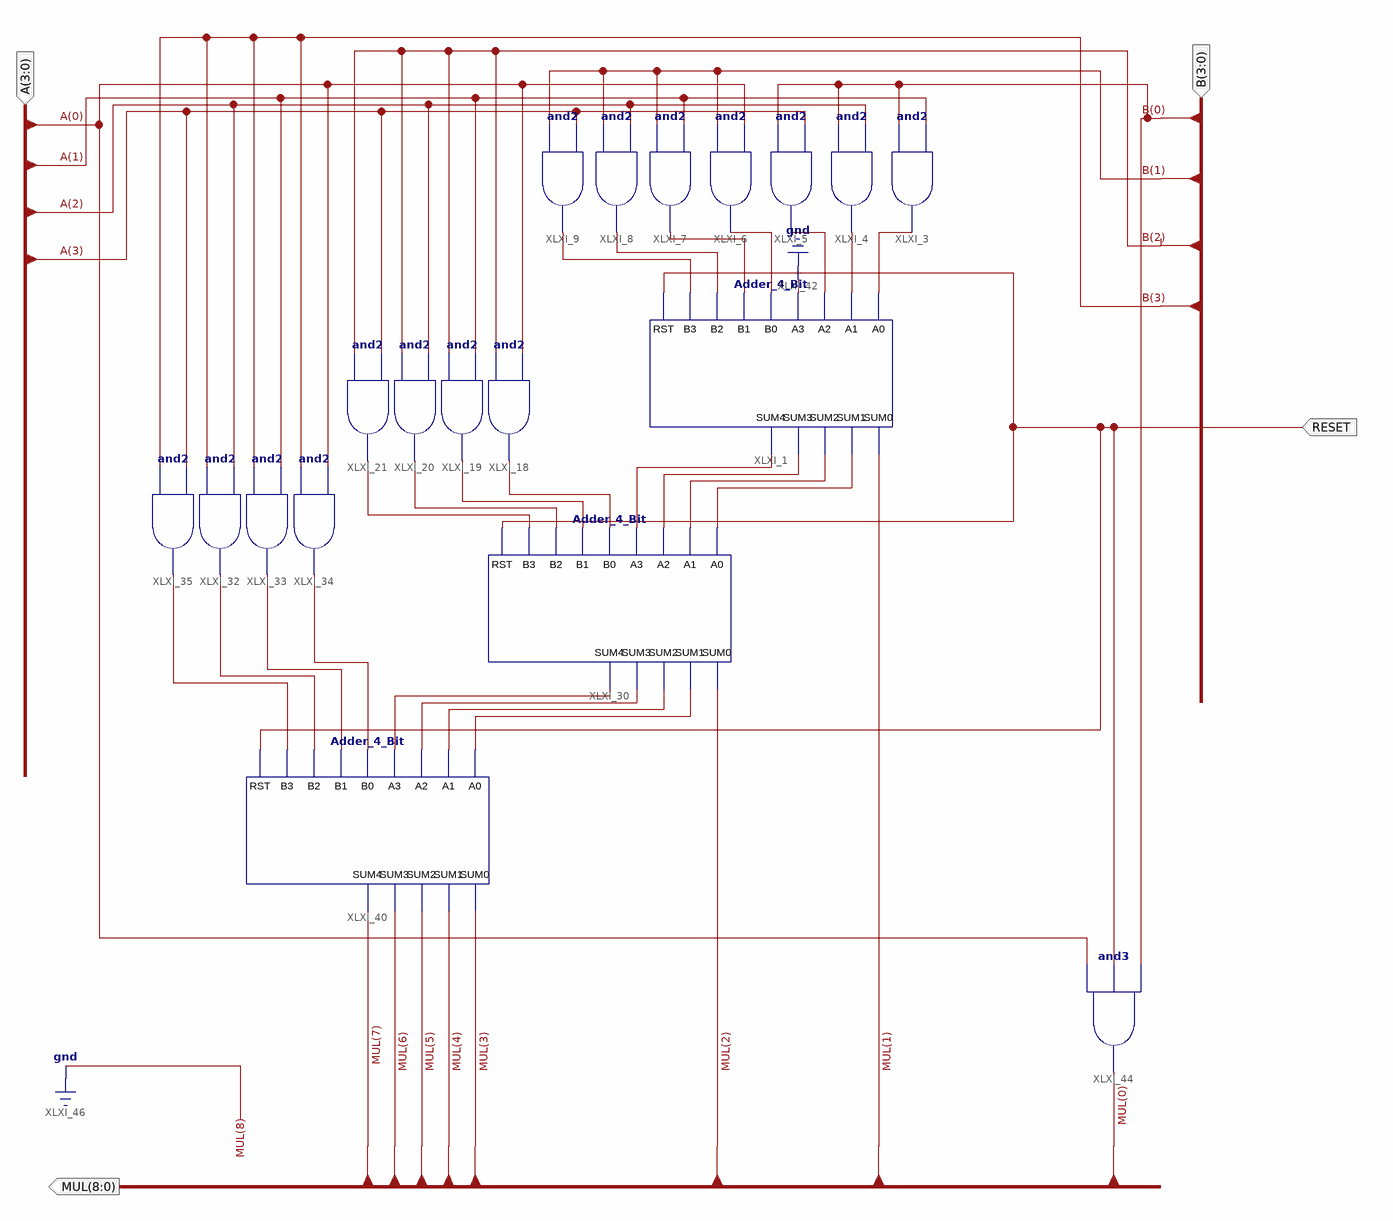
[diagram p0: schematic sheet 1]
// Xilinx ISE schematic Multiplier_4_Bit.sch (spartan6) as structural Verilog: 19 symbols, 4 ports
module Multiplier_4_Bit (
  input  [3:0] A,
  input  [3:0] B,
  input  RESET,
  output [8:0] MUL
);

  wire XLXN_21, XLXN_22, XLXN_23, XLXN_24, XLXN_25, XLXN_30, XLXN_31, XLXN_39, XLXN_40, XLXN_41, XLXN_43,
       XLXN_44, XLXN_45, XLXN_46, XLXN_50, XLXN_51, XLXN_52, XLXN_53, XLXN_54, XLXN_55, XLXN_56, XLXN_57,
       XLXN_67;

  and XLXI_3 (XLXN_21, B[0], A[1]);
  and XLXI_4 (XLXN_22, B[0], A[2]);
  and XLXI_5 (XLXN_23, B[0], A[3]);
  and XLXI_6 (XLXN_24, B[1], A[0]);
  and XLXI_7 (XLXN_25, B[1], A[1]);
  and XLXI_8 (XLXN_30, B[1], A[2]);
  and XLXI_9 (XLXN_31, B[1], A[3]);
  Adder_4_Bit XLXI_1 (
    .A0(XLXN_21), .A1(XLXN_22), .A2(XLXN_23), .A3(1'b0), .B0(XLXN_24), .B1(XLXN_25), .B2(XLXN_30),
    .B3(XLXN_31), .RST(RESET), .SUM0(MUL[1]), .SUM1(XLXN_39), .SUM2(XLXN_40), .SUM3(XLXN_41), .SUM4(XLXN_43));
  and XLXI_18 (XLXN_44, B[2], A[0]);
  and XLXI_19 (XLXN_45, B[2], A[1]);
  and XLXI_20 (XLXN_46, B[2], A[2]);
  and XLXI_21 (XLXN_67, B[2], A[3]);
  Adder_4_Bit XLXI_30 (
    .A0(XLXN_39), .A1(XLXN_40), .A2(XLXN_41), .A3(XLXN_43), .B0(XLXN_44), .B1(XLXN_45), .B2(XLXN_46),
    .B3(XLXN_67), .RST(RESET), .SUM0(MUL[2]), .SUM1(XLXN_54), .SUM2(XLXN_55), .SUM3(XLXN_56), .SUM4(XLXN_57));
  and XLXI_32 (XLXN_52, B[3], A[2]);
  and XLXI_33 (XLXN_51, B[3], A[1]);
  and XLXI_34 (XLXN_50, B[3], A[0]);
  and XLXI_35 (XLXN_53, B[3], A[3]);
  Adder_4_Bit XLXI_40 (
    .A0(XLXN_54), .A1(XLXN_55), .A2(XLXN_56), .A3(XLXN_57), .B0(XLXN_50), .B1(XLXN_51), .B2(XLXN_52),
    .B3(XLXN_53), .RST(RESET), .SUM0(MUL[3]), .SUM1(MUL[4]), .SUM2(MUL[5]), .SUM3(MUL[6]), .SUM4(MUL[7]));
  and XLXI_44 (MUL[0], A[0], RESET, B[0]);

  assign MUL[8] = 1'b0;
endmodule
